# Altium schematic sheet fx3_b.SchDoc: CYUSB3014 - B
size OrCAD B; CheckedBy: liuchao; DrawnBy: liuchao; DocumentNumber: APEX-USB5; Revision: 3.0.0; SheetNumber: 5; SheetTotal: 9
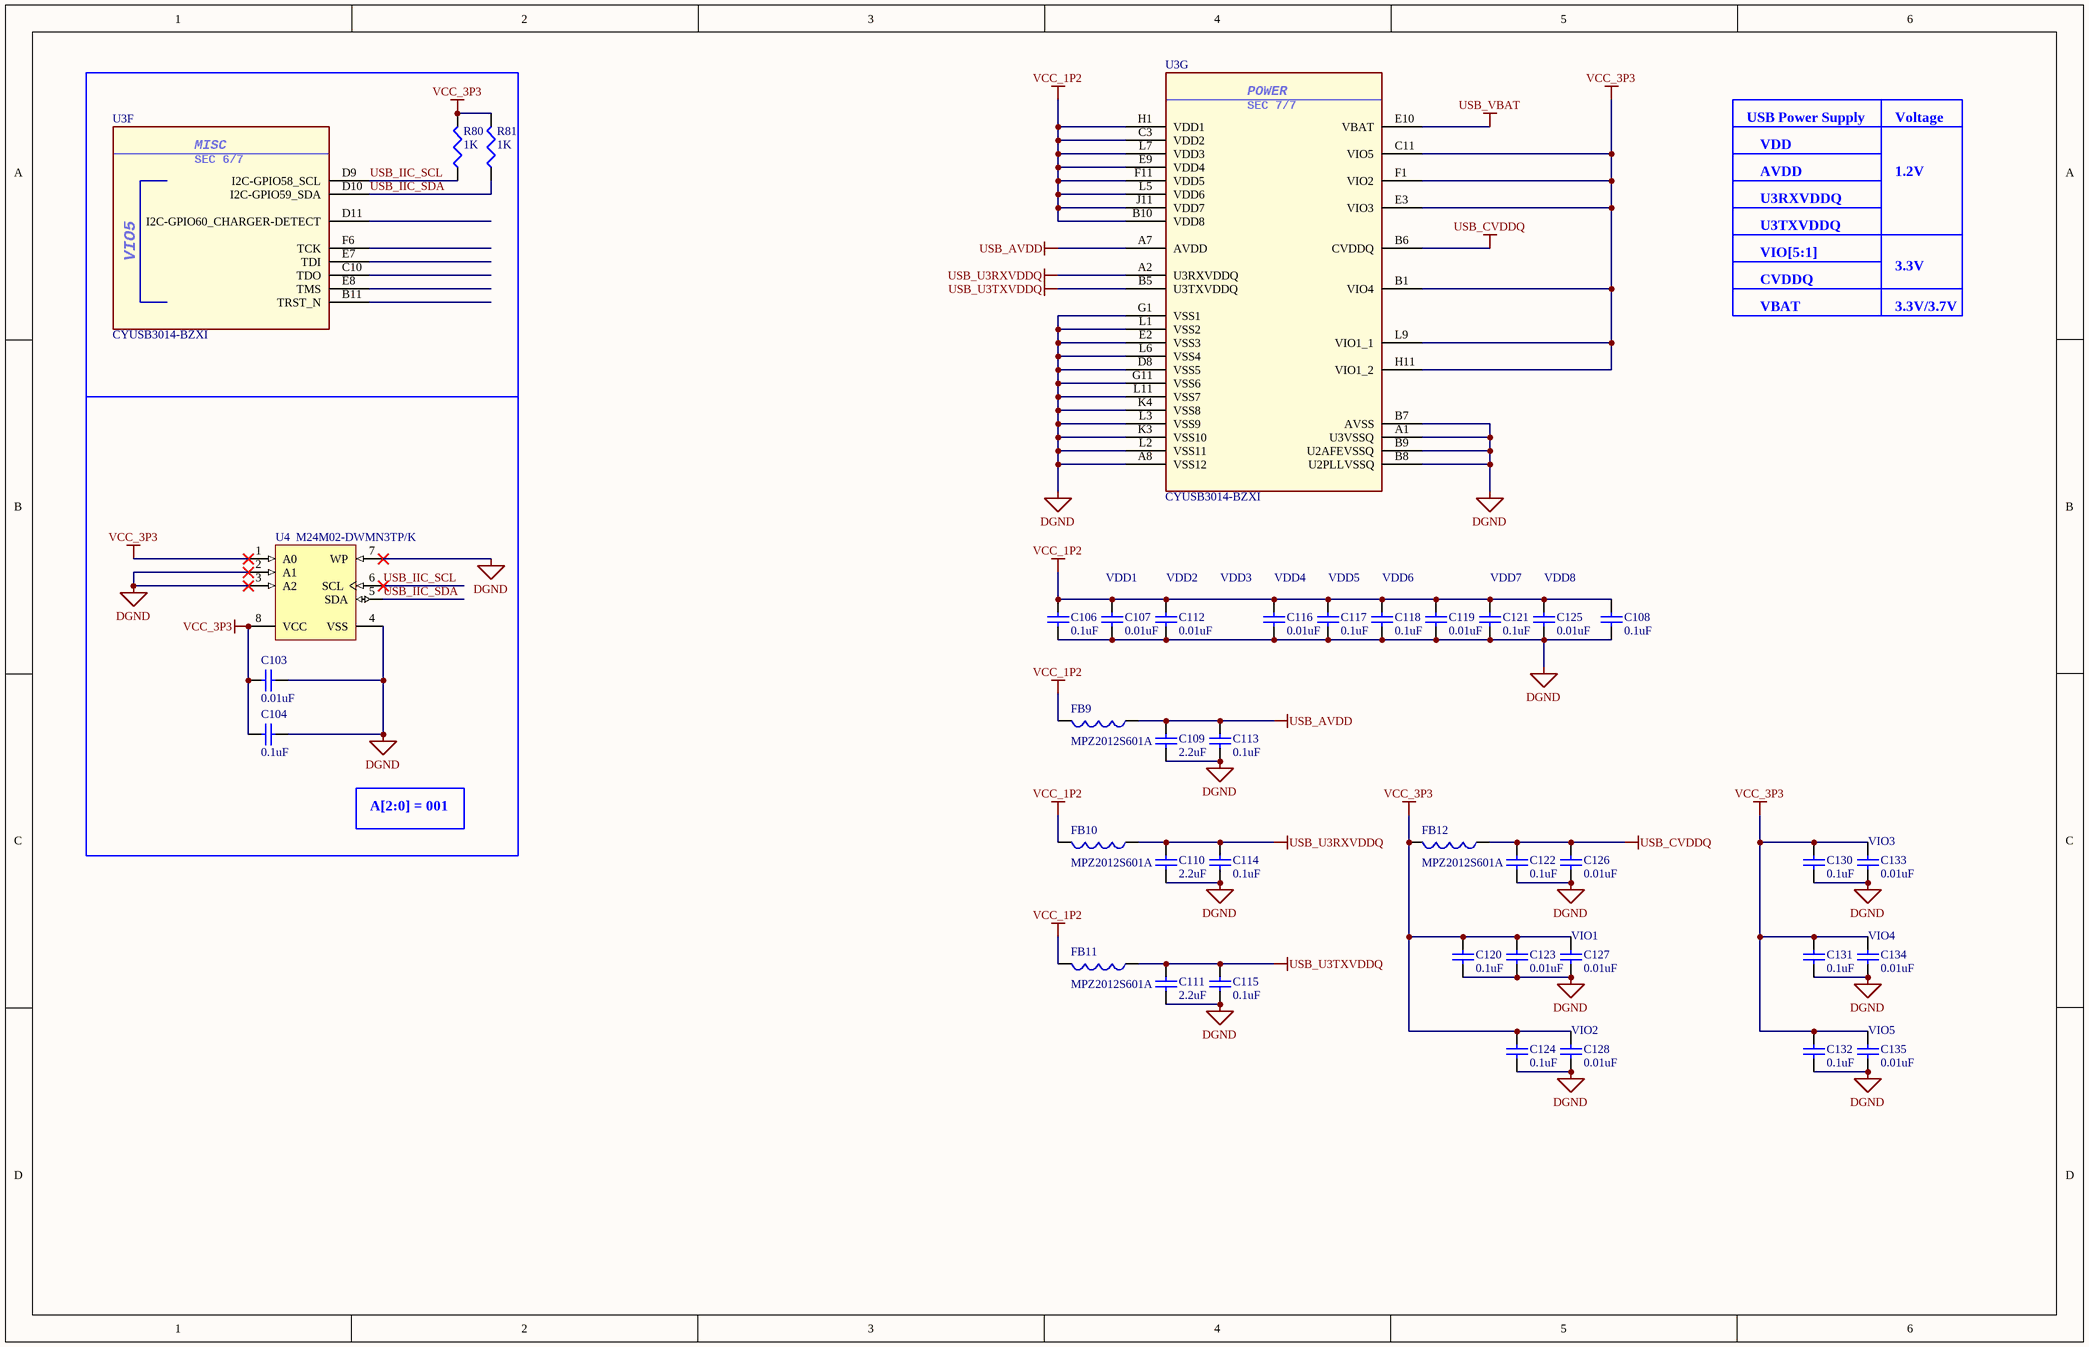
[diagram p0: fx3_b.SchDoc]

## Parts
C103  value 0.01uF  [C_0402]  (hidden comment: Capacitor)
C104  value 0.1uF  [C_0402]  (hidden comment: Capacitor)
C106  value 0.1uF  [C_0402]  (hidden comment: Capacitor)
C107  value 0.01uF  [C_0402]  (hidden comment: Capacitor)
C108  value 0.1uF  [C_0402]  (hidden comment: Capacitor)
C109  value 2.2uF  [C_0402]  (hidden comment: Capacitor)
C110  value 2.2uF  [C_0402]  (hidden comment: Capacitor)
C111  value 2.2uF  [C_0402]  (hidden comment: Capacitor)
C112  value 0.01uF  [C_0402]  (hidden comment: Capacitor)
C113  value 0.1uF  [C_0402]  (hidden comment: Capacitor)
C114  value 0.1uF  [C_0402]  (hidden comment: Capacitor)
C115  value 0.1uF  [C_0402]  (hidden comment: Capacitor)
C116  value 0.01uF  [C_0402]  (hidden comment: Capacitor)
C117  value 0.1uF  [C_0402]  (hidden comment: Capacitor)
C118  value 0.1uF  [C_0402]  (hidden comment: Capacitor)
C119  value 0.01uF  [C_0402]  (hidden comment: Capacitor)
C120  value 0.1uF  [C_0402]  (hidden comment: Capacitor)
C121  value 0.1uF  [C_0402]  (hidden comment: Capacitor)
C122  value 0.1uF  [C_0402]  (hidden comment: Capacitor)
C123  value 0.01uF  [C_0402]  (hidden comment: Capacitor)
C124  value 0.1uF  [C_0402]  (hidden comment: Capacitor)
C125  value 0.01uF  [C_0402]  (hidden comment: Capacitor)
C126  value 0.01uF  [C_0402]  (hidden comment: Capacitor)
C127  value 0.01uF  [C_0402]  (hidden comment: Capacitor)
C128  value 0.01uF  [C_0402]  (hidden comment: Capacitor)
C130  value 0.1uF  [C_0402]  (hidden comment: Capacitor)
C131  value 0.1uF  [C_0402]  (hidden comment: Capacitor)
C132  value 0.1uF  [C_0402]  (hidden comment: Capacitor)
C133  value 0.01uF  [C_0402]  (hidden comment: Capacitor)
C134  value 0.01uF  [C_0402]  (hidden comment: Capacitor)
C135  value 0.01uF  [C_0402]  (hidden comment: Capacitor)
FB9  MPZ2012S601A  [SMD_0805]
FB10  MPZ2012S601A  [SMD_0805]
FB11  MPZ2012S601A  [SMD_0805]
FB12  MPZ2012S601A  [SMD_0805]
R80  value 1K  [J1-0603]  (hidden comment: Resistor)
R81  value 1K  [J1-0603]  (hidden comment: Resistor)
U3  CYUSB3014-BZXI  [CYUSB301X_BGA121x11]  (parts F,G of 7)
U4  M24M02-DWMN3TP/K  [SOIC-SN8_N]

## Nets
DGND: C103.2 C104.2 C106.2 C107.2 C108.2 C109.2 C110.2 C111.2 C112.2 C113.2 C114.2 C115.2 C116.2 C117.2 C118.2 C119.2 C120.2 C121.2 C122.2 C123.2 C124.2 C125.2 C126.2 C127.2 C128.2 C130.2 C131.2 C132.2 C133.2 C134.2 C135.2 U3.A1(U3VSSQ) U3.A8(VSS12) U3.B7(AVSS) U3.B8(U2PLLVSSQ) U3.B9(U2AFEVSSQ) U3.D8(VSS5) U3.E2(VSS3) U3.G1(VSS1) U3.G11(VSS6) U3.K3(VSS10) U3.K4(VSS8) U3.L1(VSS2) U3.L2(VSS11) U3.L3(VSS9) U3.L6(VSS4) U3.L11(VSS7) U4.2(A1) U4.3(A2) U4.4(VSS) U4.7(WP)
USB_AVDD: C109.1 C113.1 FB9.1 U3.A7(AVDD)
USB_CVDDQ: C122.1 C126.1 FB12.1 U3.B6(CVDDQ)
USB_U3RXVDDQ: C110.1 C114.1 FB10.1 U3.A2(U3RXVDDQ)
USB_U3TXVDDQ: C111.1 C115.1 FB11.1 U3.B5(U3TXVDDQ)
USB_VBAT: U3.E10(VBAT)
VCC_1P2: C106.1 C107.1 C108.1 C112.1 C116.1 C117.1 C118.1 C119.1 C121.1 C125.1 FB9.2 FB10.2 FB11.2 U3.B10(VDD8) U3.C3(VDD2) U3.E9(VDD4) U3.F11(VDD5) U3.H1(VDD1) U3.J11(VDD7) U3.L5(VDD6) U3.L7(VDD3)
VCC_3P3: C103.1 C104.1 C120.1 C123.1 C124.1 C127.1 C128.1 C130.1 C131.1 C132.1 C133.1 C134.1 C135.1 FB12.2 R80.2 R81.2 U3.B1(VIO4) U3.C11(VIO5) U3.E3(VIO3) U3.F1(VIO2) U3.H11(VIO1_2) U3.L9(VIO1_1) U4.1(A0) U4.8(VCC)
USB_IIC_SCL: R80.1 U3.D9(I2C-GPIO58_SCL) U4.6(SCL)
USB_IIC_SDA: R81.1 U3.D10(I2C-GPIO59_SDA) U4.5(SDA)

Not connected (* = marked no-connect by the designer): U3 B11(TRST_N) C10(TDO) D11(I2C-GPIO60_CHARGER-DETECT) E7(TDI) E8(TMS) F6(TCK)

## Notes on the sheet
- USB Power Supply
- VDD
- Voltage
- AVDD
- U3RXVDDQ
- 1.2V
- VIO[5:1]
- U3TXVDDQ
- CVDDQ
- 3.3V
- VBAT
- 3.3V/3.7V
- (near C107) VDD1
- (near C112) VDD2
- VDD3
- VDD4
- VDD5
- VDD6
- VDD7
- (near C125) VDD8
- A[2:0] = 001
- (near C133) VIO3
- (near C127) VIO1
- (near C134) VIO4
- (near C128) VIO2
- (near C135) VIO5
- (in symbol CYUSB30XX, part F) MISC; SEC 6/7
- (in symbol CYUSB30XX, part G) POWER; SEC 7/7

## Library data of the parts
C103 C104 C106-C128 C130-C135 = Cap Semi: Capacitor (Semiconductor SIM Model); Published: 8-Jun-2000; LatestRevisionDate: 29-May-2009; LatestRevisionNote: IPC-7351 Footprint Added.; PackageReference: C1206; Publisher: Altium Limited; PackageDescription: Chip Capacitor
FB9-FB12 = MPZ2012X
R80 R81 = Res3: Published: 8-Jun-2000; LatestRevisionDate: 29-May-2009; LatestRevisionNote: IPC-7351 Footprint Added.; PackageReference: J1-0603; Publisher: Altium Limited; PackageDescription: Chip Resistor
U3 = CYUSB30XX: FX3 CYUSB3014
U4 = 24LC256-I/SN: 256Kbit, 400kHz, 2.5V, I2C Serial EEPROM, 8-Pin SOIC 150mil, Industrial Temperature; Manufacturer: Microchip; DatasheetVersion: revP, Oct-2007; PackageVersion: revBB, Aug-2009; PackageReference: SOIC-SN8; PackageDescription: 8-Lead Plastic Small Outline (SN) - Narrow, 3.90mm Body [SOIC]; Supplier 1: Digi-Key; Supplier Part Number 1: 24LC256-I/SN-ND; Supplier 2: Farnell; Supplier Part Number 2: 9757996; Supplier 3: Farnell; Supplier Part Number 3: 1660005; Supplier 4: Newark; Supplier Part Number 4: 27C9144; Supplier 5: Mouser; Supplier Part Number 5: 579-24LC256-I/SN; Mounting Technology: Surface Mount; Code_JEDEC: MS-012; Code_IPC: SOIC127P600-8; PartNumber: 24LC256-I/SN; ComponentLink1Description: Manufacturer URL; ComponentLink1URL: http://www.microchip.com/; ComponentLink2Description: Datasheet; ComponentLink2URL: http://ww1.microchip.com/downloads/en/DeviceDoc/21203P.pdf; ComponentLink3Description: Package Specification; ComponentLink3URL: http://www.microchip.com/stellent/groups/techpub_sg/documents/packagingspec/en012702.pdf